# Altium schematic sheet Ethernet.SchDoc
size 594 x 420 mm; Scale: 1:1; Разраб.: Иванов; Обозначение документа: АБВГ.123456.001 Э3; Пров.: Петров; Утв.: Сидоров; Наименование организации: ОАО "Концерн "МПО-Гидроприбор"; Перв. применение: АБВГ.123456.000; Наименование изделия 1: Плата; Наименование изделия 2: Схема электрическая; Наименование изделия 3: принципиальная; Нач. отд.: Нач. отд.; Фамилия нач. отд.: Сидоров
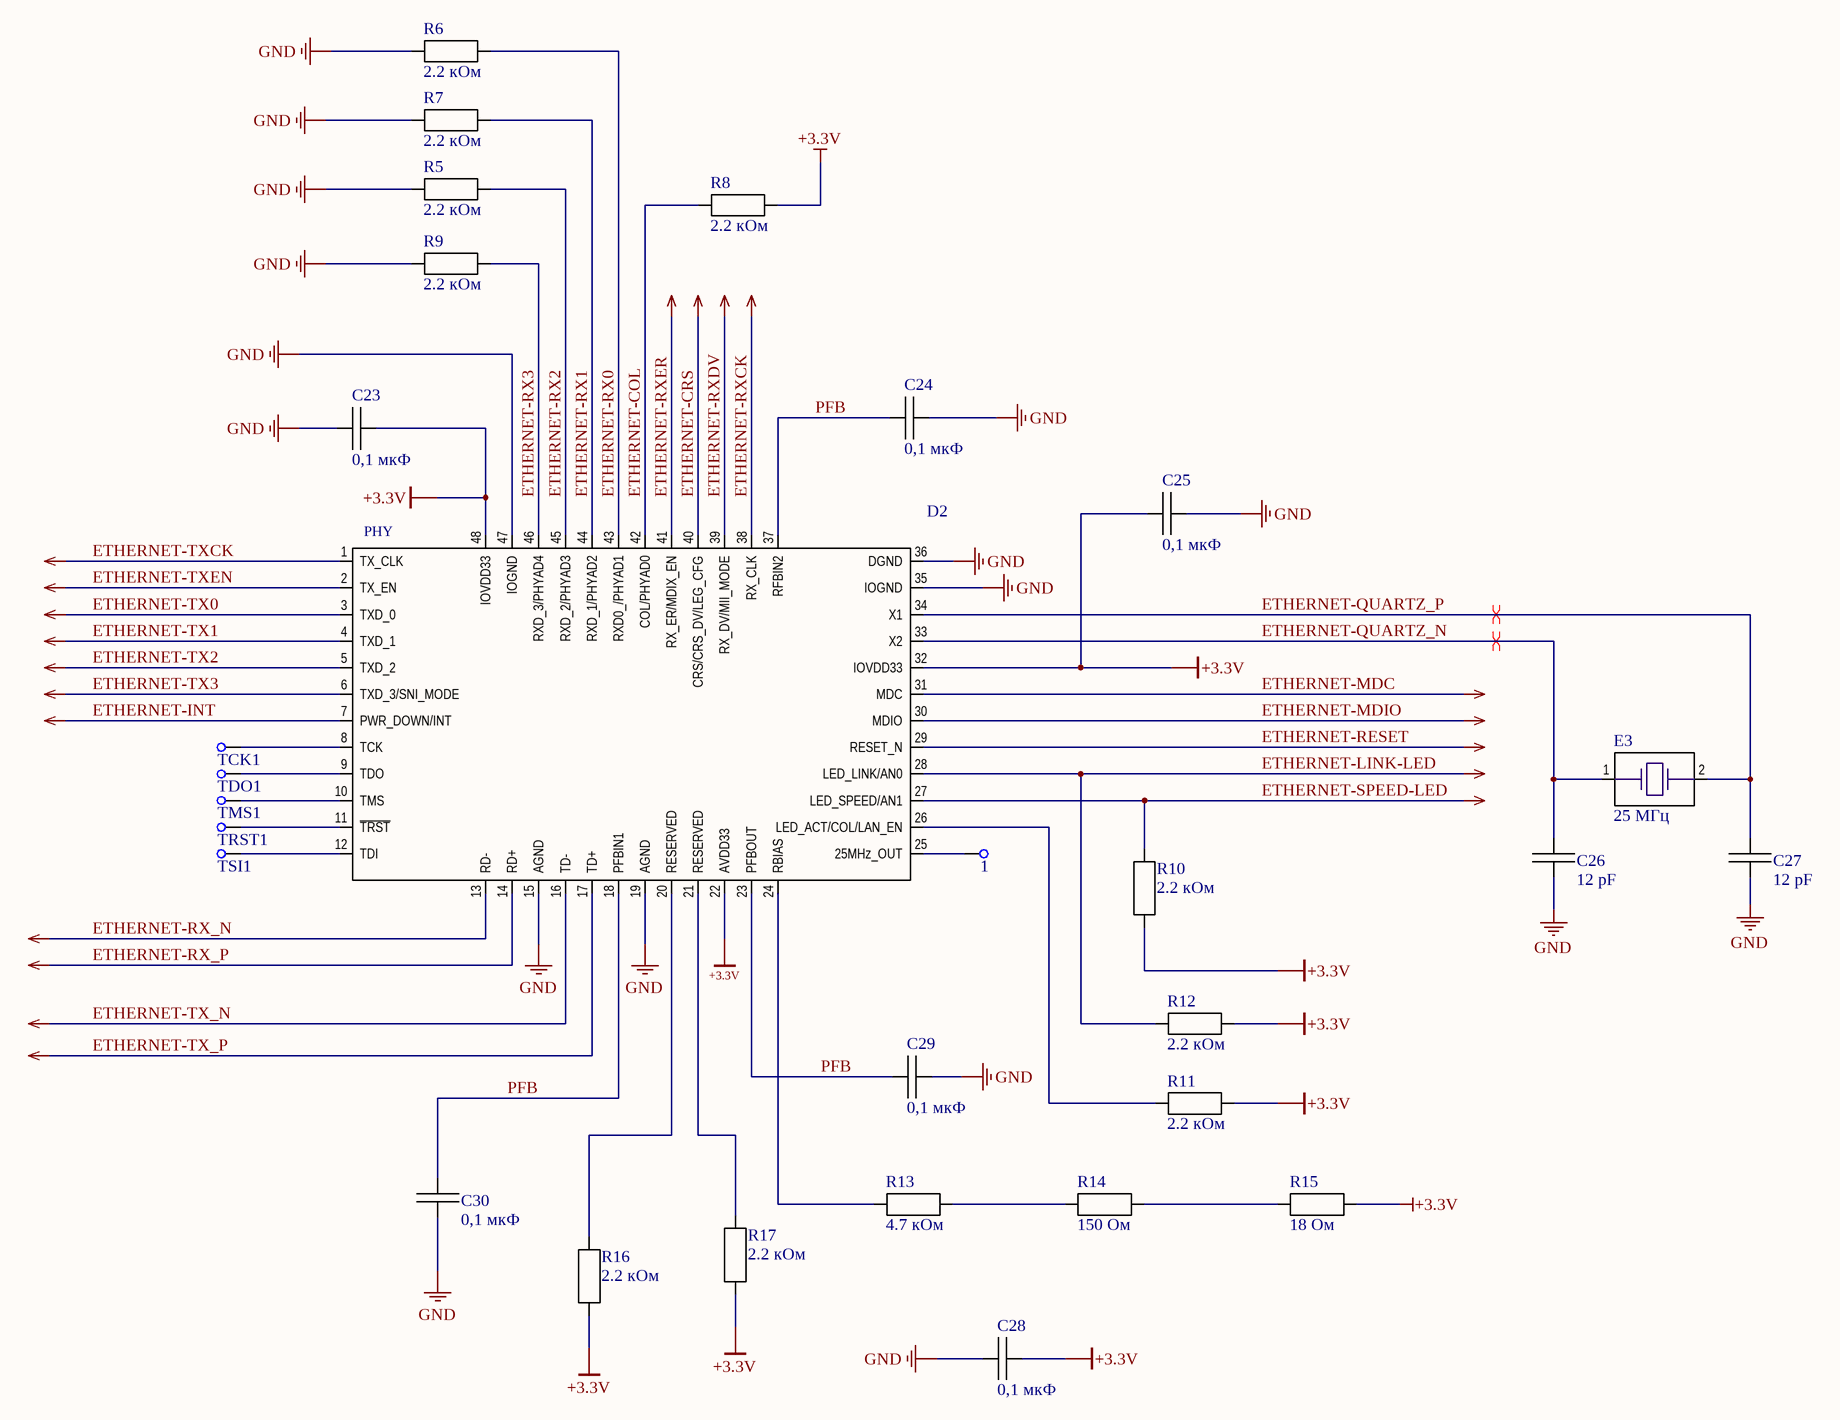
[diagram p0: Ethernet.SchDoc]

## Parts
1  (no value)  [PAD0,7X1.5]
C23  0,1 мкФ  [0603-AVX]
C24  0,1 мкФ  [0603-AVX]
C25  0,1 мкФ  [0603-AVX]
C26  12 pF  [0603-AVX]
C27  12 pF  [0603-AVX]
C28  0,1 мкФ  [0603-AVX]
C29  0,1 мкФ  [0603-AVX]
C30  0,1 мкФ  [0603-AVX]
D2  (no value)  [S-PQFP-G48]
E3  25 МГц  [HC49]
R5  2.2 кОм  [Р1-8МП-0,125]
R6  2.2 кОм  [Р1-8МП-0,125]
R7  2.2 кОм  [Р1-8МП-0,125]
R8  2.2 кОм  [Р1-8МП-0,125]
R9  2.2 кОм  [Р1-8МП-0,125]
R10  2.2 кОм  [Р1-8МП-0,125]
R11  2.2 кОм  [Р1-8МП-0,125]
R12  2.2 кОм  [Р1-8МП-0,125]
R13  4.7 кОм  [Р1-8МП-0,125]
R14  150 Ом  [Р1-8МП-0,125]
R15  18 Ом  [Р1-8МП-0,125]
R16  2.2 кОм  [Р1-8МП-0,125]
R17  2.2 кОм  [Р1-8МП-0,125]
TCK1  (no value)  [PAD0,7X1.5]
TDO1  (no value)  [PAD0,7X1.5]
TMS1  (no value)  [PAD0,7X1.5]
TRST1  (no value)  [PAD0,7X1.5]
TSI1  (no value)  [PAD0,7X1.5]

## Nets
+3.3V: C23.2 C25.1 C28.2 D2.22(AVDD33) D2.32(IOVDD33) D2.48(IOVDD33) R8.1 R10.2 R11.1 R12.1 R15.1 R16.2 R17.2
ETHERNET-CRS: D2.1(TX_CLK) D2.2(TX_EN) D2.3(TXD_0) D2.4(TXD_1) D2.5(TXD_2) D2.6(TXD_3/SNI_MODE) D2.7(PWR_DOWN/INT) D2.13(RD-) D2.14(RD+) D2.16(TD-) D2.17(TD+) D2.27(LED_SPEED/AN1) D2.28(LED_LINK/AN0) D2.29(RESET_N) D2.30(MDIO) D2.31(MDC) D2.38(RX_CLK) D2.39(RX_DV/MII_MODE) D2.40(CRS/CRS_DV/LEG_CFG) D2.41(RX_ER/MDIX_EN) R10.1 R12.2  [also labelled ETHERNET-INT, ETHERNET-LINK-LED, ETHERNET-MDC, ETHERNET-MDIO, ETHERNET-RESET, ETHERNET-RX_N, ETHERNET-RX_P, ETHERNET-RXCK, ETHERNET-RXDV, ETHERNET-RXER, ETHERNET-SPEED-LED, ETHERNET-TX0, ETHERNET-TX1, ETHERNET-TX2, ETHERNET-TX3, ETHERNET-TX_N, ETHERNET-TX_P, ETHERNET-TXCK, ETHERNET-TXEN]
GND: C23.1 C24.2 C25.2 C26.1 C27.1 C28.1 C29.1 C30.1 D2.15(AGND) D2.19(AGND) D2.35(IOGND) D2.36(DGND) D2.47(IOGND) R5.1 R6.1 R7.1 R9.1
ETHERNET-COL: D2.42(COL/PHYAD0) R8.2
ETHERNET-QUARTZ_N: C26.2 D2.33(X2) E3.1
ETHERNET-QUARTZ_P: C27.2 D2.34(X1) E3.2
ETHERNET-RX0: D2.43(RXD0_/PHYAD1) R6.2
ETHERNET-RX1: D2.44(RXD_1/PHYAD2) R7.2
ETHERNET-RX2: D2.45(RXD_2/PHYAD3) R5.2
ETHERNET-RX3: D2.46(RXD_3/PHYAD4) R9.2
PFB: C24.1 C29.2 C30.2 D2.18(PFBIN1) D2.23(PFBOUT) D2.37(RFBIN2)
Net1_1: 1.1 D2.25(25MHz_OUT)
NetD2_8: D2.8(TCK) TCK1.1
NetD2_9: D2.9(TDO) TDO1.1
NetD2_10: D2.10(TMS) TMS1.1
NetD2_11: D2.11(~{TRST}) TRST1.1
NetD2_12: D2.12(TDI) TSI1.1
NetD2_20: D2.20(RESERVED) R16.1
NetD2_21: D2.21(RESERVED) R17.1
NetD2_24: D2.24(RBIAS) R13.2
NetD2_26: D2.26(LED_ACT/COL/LAN_EN) R11.2
NetR13_1: R13.1 R14.2
NetR14_1: R14.1 R15.2

## Layout directives
differential pair: ETHERNET-QUARTZ_N, ETHERNET-QUARTZ_P

## Notes on the sheet
- Перв. примен.
- Справ. №
- Подп. и дата
- Инв. № дубл.
- Взам. инв. №
- Разраб.
- Изм.
- Лист
- № докум.
- Подп.
- Дата
- Лит.
- Масса
- Масштаб
- Пров.
- Т.контр.
- Листов
- Инв. № подл.
- Утв.
- Н.контр.
- Копировал
- Формат А2
- (in symbol DP83848) PHY

## Library data of the parts
1 TCK1 TDO1 TMS1 TRST1 TSI1 = КП_0,7Х1,5: Category: НЕТ
C23-C25 C28-C30 = 0603-X7R-0,1мкФ-16В-10%: Manufacturer: AVX; ManufacturerPartNumber: 0603YC104KAT2A; TKE: X7R; Power/Voltage: 16 В; Tolerance: ±10%; Category: Конденсатор; Value: 0,1 мкФ; PartNumber: 0603YC104KAT2A
C26 C27 = 0603-X7R-0,01мкФ-50В-10%: Manufacturer: AVX; ManufacturerPartNumber: 06035C103KAT4A; TKE: X7R; Power/Voltage: 50 В; Tolerance: ±10%; Category: Конденсатор; Value: 12 pF; PartNumber: 06035C103KAT4A
D2 = DP83848: Ethernet physical layer transceiver; Manufacturer: Texas Instruments; Category: Микросхема; ManufacturerPartNumber: DP83848
E3 = Crystal oscillator 25Mhz: Category: Генератор; ManufacturerPartNumber: Crystal oscillator 25Mhz; Value: 25 МГц
R5-R17 = Р1-8МП-0,125-1 кОм±1%: PartNumber: ОЖ0.467.164ТУ; ManufacturerPartNumber: Р1-8МП-0,125-1 кОм±1%-0,5-Л; Tolerance: ±1%-0,5-Л; Power/Voltage: 0,125; Category: Резистор
  R5-R12 R16 R17: Value: 2.2 кОм
  R13: Value: 4.7 кОм
  R14: Value: 150 Ом
  R15: Value: 18 Ом